# EasyEDA Pro project WLED_OLED_2025-11-16.epro

# Schematic WLED
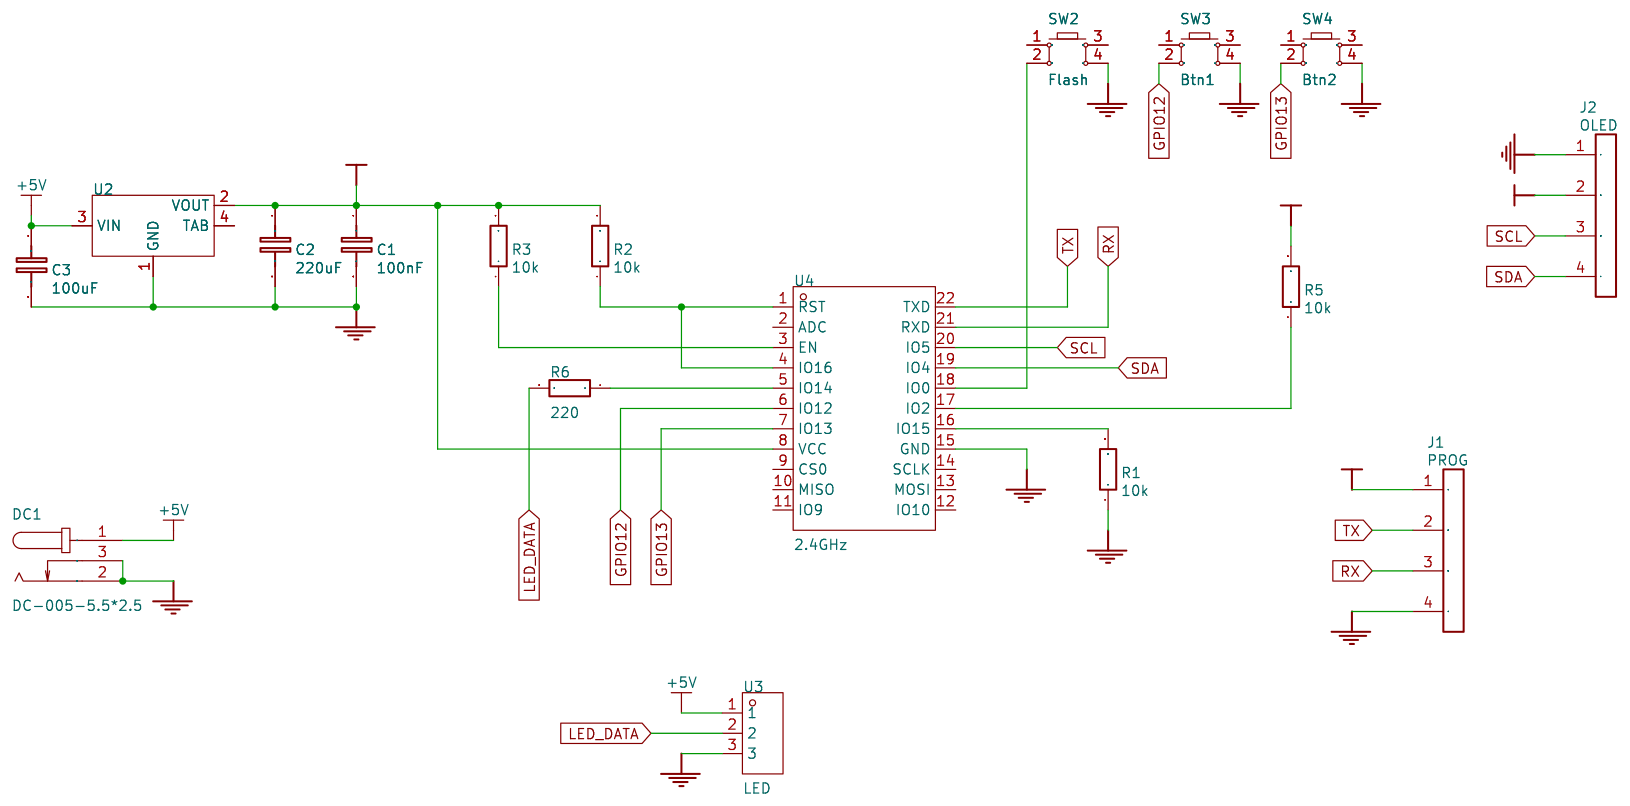
[diagram p0: schematic sheet]

## Parts
C1  100nF  [C1210]
C2  220uF  [C1210]
C3  100uF  [C1210]
DC1  DC-005-5.5*2.5  [DC-IN-TH_DC-005-2]
J1  PROG  [HDR-TH_4P-P2.54-V-C4_TH-4_2.5X10.5X2.54P]
J2  OLED  [OLED-TH_4P-P2.54-L27.8-W27.3]
R1  10k  [D0805]
R2  10k  [D0805]
R3  10k  [D0805]
R5  10k  [D0805]
R6  220  [D0805]
SW2  Flash  [KEY-TH_4P-L6.0-W6.0-P3.90-LS6.5]
SW3  Btn1  [KEY-TH_4P-L6.0-W6.0-P3.90-LS6.5]
SW4  Btn2  [KEY-TH_4P-L6.0-W6.0-P3.90-LS6.5]
U2  -  [SOT-223_L6.7-W3.5-P2.30-BR]
U3  LED  [HDR-TH_3P-P2.54-V-M_GREEN]
U4  2.4GHz  [WIRELM-SMD_ESP-12F]

## Library data of the parts
C1-C3 = ?: nameAlias: Value(F); spicePre: C; spiceSymbolName: Capacitor
DC1 = DC-005-5.5*2.5: Supplier Part: C9900017043; Supplier Footprint: DC-005; JLCPCB Part Class: Extended Part; Supplier: LCSC
J1 J2 = CON1X04: Contributor: KiCad; spicePre: J
R1-R3 R5 R6 = ?: nameAlias: Value(Ω); spicePre: R; spiceSymbolName: Resistor
SW2-SW4 = Key_TH_6x6x4.5: Supplier Footprint: Through
U2 = AMS1117_1.2V: Supplier Footprint: SOT-223
U3 = DS1020-03ST1D: Supplier Part: C9900146670; Supplier Footprint: 3pin; Supplier: LCSC
U4 = ESP-12F: Wireless Standard:WIFI4 Interface Type:IO；UART Frequency:2.4GHz Antenna Type:PCB Output Power:15dBm Output Power:15dBm Voltage - Supply:3.3V Voltage - Supply:3.3V Receive  Current:55mA Send  Current:375mA Sensitivity:-96dBm Sensitivity:-96dBm Operating Te; LCSC Part Name: ESP8266 WiFi模组,32Mbit Flash, 通用模组; Supplier Part: C19949064; Manufacturer: DOIT(四博智联); Supplier Footprint: SMD,24x16mm; JLCPCB Part Class: Extended Part; Datasheet: https://atta.szlcsc.com/upload/public/pdf/source/20240112/4C731B83AC84B82D8ABE33233BB0FED4.pdf; Supplier: LCSC; Wireless Standard: WIFI4; Interface Type: IO；UART; Antenna Type: PCB; Output Power: 15dBm; Voltage - Supply: 3.3V; Receive  Current: 55mA; Send  Current: 375mA; Sensitivity: -96dBm; Operating Temperature: -40℃~+85℃

## Nets
+5V: C3.1 DC1.1 U2.3(VIN) U3.1
GND: C1.2 C2.2 C3.2 DC1.2 DC1.3 J1.4 J2.1 R1.1 SW2.4 SW3.4 SW4.4 U2.1(GND) U3.3 U4.15(GND)
VCC: C1.1 C2.1 J1.1 J2.2 R2.2 R3.2 R5.2 U2.2(VOUT) U4.8(VCC)
GPIO12: SW3.2 U4.6(IO12)
GPIO13: SW4.2 U4.7(IO13)
LED_DATA: R6.2 U3.2
RX: J1.3 U4.21(RXD)
SCL: J2.3 U4.20(IO5)
SDA: J2.4 U4.19(IO4)
TX: J1.2 U4.22(TXD)
$1N2: R1.2 U4.16(IO15)
$1N4: SW2.2 U4.18(IO0)
$1N7: R5.1 U4.17(IO2)
$1N10: R3.1 U4.3(EN)
$1N11: R2.1 U4.1(RST) U4.4(IO16)
$1N937: R6.1 U4.5(IO14)

Not connected (* = marked no-connect by the designer): SW2 1 3; SW3 1 3; SW4 1 3; U2 4(TAB); U4 2(ADC) 9(CS0) 10(MISO) 11(IO9) 12(IO10) 13(MOSI) 14(SCLK)

# Board PCB2
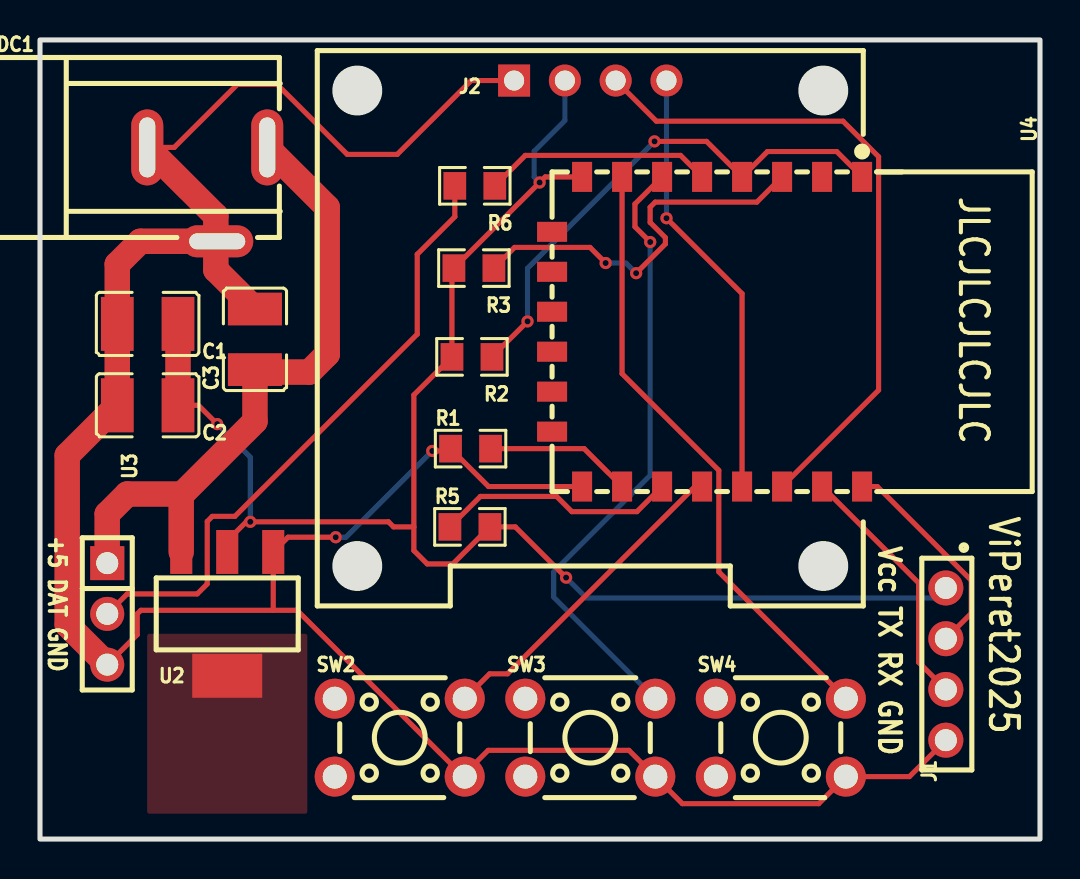
[diagram p1: board, top side]
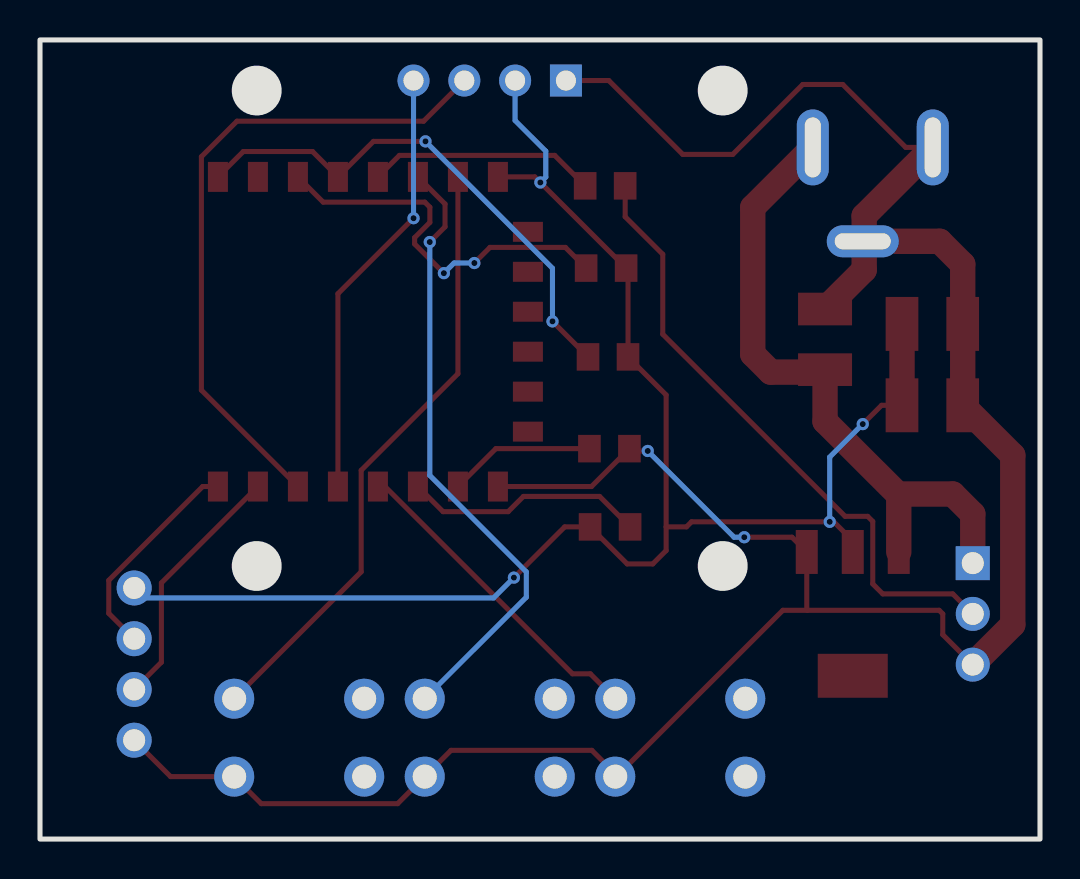
[diagram p2: board, bottom side, seen from below]

Outline 50 x 40 mm; copper layers: Top Layer, Bottom Layer. Coordinates in mm from the lower left corner of the outline.
Outline path: rectangle 0,40 50,0
Stack: Top Layer 0.035mm / Dielectric1 1.51mm FR4 er 4.5 / Bottom Layer 0.035mm

## Design rules (mm)
net +5V: +5V
template: JLCPCB Capability(Two Layers Board)
spacing copperThickness1oz (default): track to track 0.102, other pairs 0.152 to 0.3
spacing copperThickness2oz: track to track 0.203, other pairs 0.152 to 0.3
track width copperThickness1oz (default): min 0.127, default 0.254, max 2.54
track width copperThickness2oz: min 0.203, default 0.254, max 2.54
differential pair differentialPair (default): width min 0.127, default 0.254, max 2.54; gap min 0.152, default 0.152
via viaSize (default): diameter min 0.5, default 0.61, max 10; hole min 0.3, default 0.305, max 6.3
pour e623 uses copperRegion

## Placement (name value [footprint] x y rotation side)
C1  100nF  [C1210]  5.38 25.79 180 top
C2  220uF  [C1210]  5.38 21.71 180 top
C3  100uF  [C1210]  10.75 25.01 90 top
DC1  DC-005-5.5*2.5  [DC-IN-TH_DC-005-2]  8.36 32.27 0 top
J1  PROG  [HDR-TH_4P-P2.54-V-C4_TH-4_2.5X10.5X2.54P]  45.29 8.76 270 top
J2  OLED  [OLED-TH_4P-P2.54-L27.8-W27.3]  27.51 37.97 0 top
R1  10k  [D0805]  21.53 19.54 0 top
R2  10k  [D0805]  21.6 24.13 180 top
R3  10k  [D0805]  21.69 28.58 180 top
R5  10k  [D0805]  21.5 15.63 0 top
R6  220  [D0805]  21.74 32.7 180 top
SW2  Flash  [KEY-TH_4P-L6.0-W6.0-P3.90-LS6.5]  17.99 5.07 0 top
SW3  Btn1  [KEY-TH_4P-L6.0-W6.0-P3.90-LS6.5]  27.51 5.07 0 top
SW4  Btn2  [KEY-TH_4P-L6.0-W6.0-P3.90-LS6.5]  37.04 5.07 0 top
U2  -  [SOT-223_L6.7-W3.5-P2.30-BR]  9.36 11.27 90 top
U3  LED  [HDR-TH_3P-P2.54-V-M_GREEN]  3.36 11.27 270 top
U4  2.4GHz  [WIRELM-SMD_ESP-12F]  33.35 25.39 270 top

## Footprints (pads in the part's own frame, mm; a bottom-side part is the same pattern mirrored in y, then rotated)
C1210
  rect 1.635x2.7 smd: 1(-1.518,0) 2(1.518,0)
D0805
  rect 1.133x1.377 smd: 1(-1,0) 2(1,0)
DC-IN-TH_DC-005-2
  oval 1.6x3.8 hole 0.8x3: 1(2.999,2.35) 2(-3,2.35)
  oval 3.6x1.6 hole 2.8x0.8: 3(0.5,-2.35)
HDR-TH_3P-P2.54-V-M_GREEN
  rect 1.7x1.7 hole 1.1: 1(-2.54,0)
  round 1.7 hole 1.1: 2(0,0) 3(2.54,0)
HDR-TH_4P-P2.54-V-C4_TH-4_2.5X10.5X2.54P
  round 1.75 hole 1.1: 1(-3.81,0) 2(-1.27,0) 3(1.27,0) 4(3.81,0)
KEY-TH_4P-L6.0-W6.0-P3.90-LS6.5
  round 2 hole 1.2: 1(-3.25,1.95) 2(3.25,1.95) 3(-3.25,-1.95) 4(3.25,-1.95)
OLED-TH_4P-P2.54-L27.8-W27.3
  rect 1.6x1.6 hole 1: 1(-3.81,0)
  round 1.6 hole 1: 2(-1.27,0) 3(1.27,0) 4(3.81,0)
SOT-223_L6.7-W3.5-P2.30-BR
  rect 2.2x1.1 smd: 1(3.099,-2.3) 2(3.099,0) 3(3.099,2.3)
  rect 2.2x3.5 smd: 4(-3.099,0)
WIRELM-SMD_ESP-12F
  rect 1.5x1 smd: 1(-7.75,7.75) 2(-7.75,5.75) 3(-7.75,3.75) 4(-7.75,1.75) 5(-7.75,-0.25) 6(-7.75,-2.25) 7(-7.75,-4.25) 8(-7.75,-6.25) 15(7.75,-6.25) 16(7.75,-4.25) 17(7.75,-2.25) 18(7.75,-0.25) 19(7.75,1.75) 20(7.75,3.75) 21(7.75,5.75) 22(7.75,7.75)
  rect 1x1.5 smd: 9(-5,-7.75) 10(-3,-7.75) 11(-1,-7.75) 12(1,-7.75) 13(3,-7.75) 14(5,-7.75)

## Nets
As in the schematic.

Pads without a net: SW2 1 3; SW3 1 3; SW4 1 3; U4 2 9 10 11 12 13 14

## Via types
v1: diameter 0.61, hole 0.305, Top Layer to Bottom Layer, 12 vias

## Routing (per net, layer and track width the routed paths; a pad name or vN(x,y) marks a point on that pad's centre or on a via; arc(x,y) is an arc through that point)
+5V: length 32.9
  Top Layer w1.27: 7.11,17.27 4.36,17.27 3.36,16.27 U3.1 ; 7.11,17.27 10.75,20.91 C3.1 10.87,23.37 13.46,23.37 14.36,24.27 14.36,31.62 DC1.1 ; 7.11,17.27 7.06,17.22 U2.3
GND: length 131.9
  Top Layer w0.254: v1(14.79,15.11) 12.4,15.11 U2.1 11.66,11.47 11.64,11.45 ; 21.14,3.17 12.86,11.45 11.64,11.45 ; 21.14,3.17 21.18,3.12 SW2.4 ; 21.14,3.17 22.41,4.44 29.45,4.44 SW3.4 32.12,1.77 38.94,1.77 SW4.4 43.47,3.12 J1.4 ; 11.64,11.45 5.04,11.45 4.86,11.27 4.86,10.23 U3.3 ; J2.1 21.56,37.97 17.86,34.27 15.36,34.27 11.86,37.77 9.86,37.77 6.71,34.62 DC1.2 ; 8.79,29.85 DC1.3 ; U4.15 22.43,17.64 R1.1 20.41,19.43 v1(19.61,19.43)
  Top Layer w1.27: 8.79,29.92 8.79,31.19 DC1.2 ; 8.79,29.92 5.01,29.92 3.86,28.77 C1.2 C2.2 1.36,19.21 1.36,10.73 U3.3 ; 8.79,29.92 DC1.3 ; 8.79,29.92 8.79,28.49 C3.2
  Bottom Layer w0.254: v1(19.61,19.43) 15.29,15.11 v1(14.79,15.11)
VCC: length 80.8
  Top Layer w0.254: U4.8 25.26,33.14 v1(24.98,32.87) R3.2 20.6,28.48 R2.2 18.69,22.23 18.69,15.63 ; v1(26.31,13.09) 23.76,15.63 R5.2 20.64,13.77 19.36,13.77 18.69,14.44 18.69,15.63 ; 18.69,15.63 17.68,15.63 17.42,15.88 10.31,15.88 9.36,14.93 U2.2 ; C2.1 7.92,21.71 v1(8.86,20.77)
  Top Layer w1.27: C1.1 C2.1
  Bottom Layer w0.254: v1(8.86,20.77) 10.51,19.12 v1(10.51,15.88) ; J1.1 44.79,12.07 27.32,12.07 v1(26.31,13.09) ; J2.2 26.24,35.97 24.71,34.43 24.71,33.14 v1(24.98,32.87)
GPIO12: length 31.1
  Top Layer w0.254: U4.6 29.75,31.79 29.75,30.65 v1(30.51,29.88)
  Bottom Layer w0.254: SW3.2 25.68,12.1 25.68,13.37 30.51,18.2 v1(30.51,29.88)
GPIO13: length 30.8
  Top Layer w0.254: U4.7 29.1,23.29 33.94,18.45 33.94,13.37 SW4.2
LED_DATA: length 31.3
  Top Layer w0.254: U3.2 4.36,12.27 7.86,12.27 8.36,12.77 8.36,15.9 8.62,16.15 9.74,16.15 18.86,25.27 18.86,29.27 20.74,31.15 R6.2
RX: length 12.7
  Top Layer w0.254: J1.3 43.93,8.85 43.93,12.82 U4.21
SCL: length 33.2
  Top Layer w0.254: J2.3 30.82,35.93 40.15,35.93 41.93,34.15 41.93,22.47 U4.20
SDA: length 21.9
  Top Layer w0.254: v1(31.32,31.08) 35.1,27.3 U4.19
  Bottom Layer w0.254: v1(31.32,31.08) J2.4
TX: length 10.9
  Top Layer w0.254: U4.22 41.87,17.64 46.56,12.95 46.56,11.3 J1.2
$1N2: length 7.4
  Top Layer w0.254: U4.16 27.21,19.54 R1.2
$1N4: length 16.3
  Top Layer w0.254: SW2.2 22.48,8.27 23.38,8.27 32.75,17.64 U4.18
$1N7: length 12.1
  Top Layer w0.254: U4.17 29.85,16.39 26.59,16.39 25.83,17.15 22.02,17.15 R5.1
$1N10: length 19.5
  Top Layer w0.254: R3.1 23.73,29.62 27.5,29.62 v1(28.28,28.83) ; U4.3 35.84,31.88 30.76,31.88 30.51,31.63 30.51,30.87 31.27,30.1 31.27,29.79 v1(29.81,28.33)
  Bottom Layer w0.254: v1(28.28,28.83) 29.3,28.83 v1(29.81,28.33)
$1N11: length 26.3
  Top Layer w0.254: v1(30.73,34.92) 33.33,34.92 U4.4 36.37,34.41 39.83,34.41 U4.1 ; R2.1 v1(24.38,25.91)
  Bottom Layer w0.254: v1(24.38,25.91) 24.38,28.57 v1(30.73,34.92)
$1N937: length 11.4
  Top Layer w0.254: U4.5 32.03,34.22 24.27,34.22 R6.1

## Copper pours and planes (outline as drawn; the poured copper is in the pictures)
TAB on Top Layer: 5.36,10.27 13.36,10.27 13.36,1.27 5.36,1.27

## Text on the board
Top Silkscreen Layer: +5 DAT GND | Vcc TX RX GND | JLCJLCJLCJLC | ViPeret2025
